# Altium schematic sheet C.SchDoc
size A
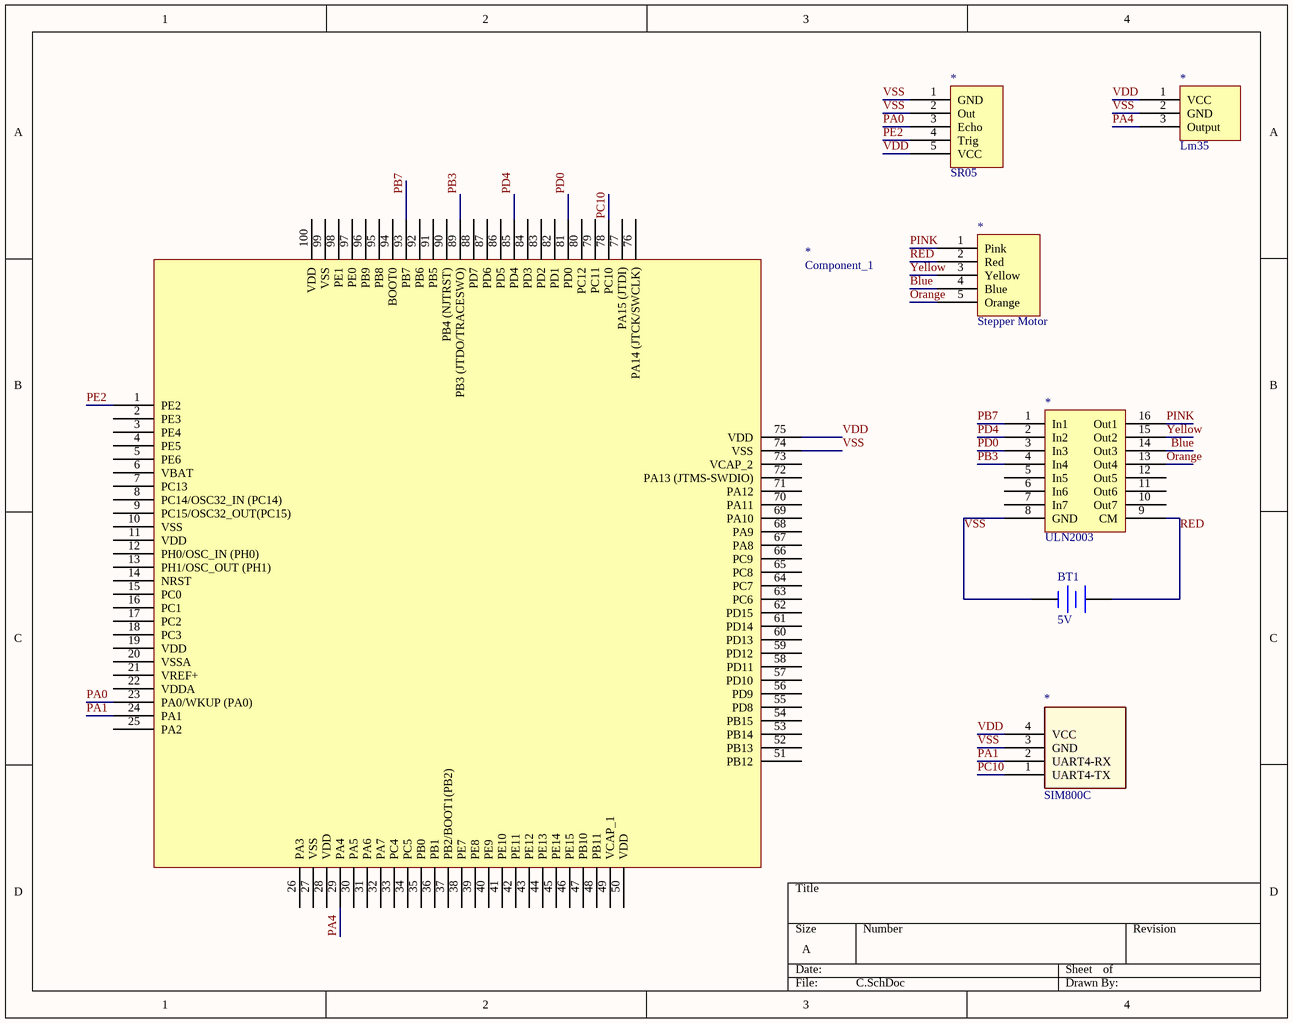
[diagram p0: C.SchDoc]

## Parts
(Parts that share a designator on the sheet are numbered #1, #2 ... from top to bottom, then left to right.)
*#1  SR05
*#2  Lm35
*#3  Stepper Motor
*#4  ULN2003
*#5  Component_1
*#6  SIM800C
BT1  5V  [BAT-2]

## Nets
Blue: *#3.4(Blue) *#4.14(Out3)
Orange: *#3.5(Orange) *#4.13(Out4)
PA0: *#1.3(Echo) *#5.23(PA0/WKUP_(PA0))
PA1: *#5.24(PA1) *#6.2(UART4-RX)
PA4: *#2.3(Output) *#5.29(PA4)
PB3: *#4.4(In4) *#5.89(PB3_(JTDO/TRACESWO))
PB7: *#4.1(In1) *#5.93(PB7)
PC10: *#5.78(PC10) *#6.1(UART4-TX)
PD0: *#4.3(In3) *#5.81(PD0)
PD4: *#4.2(In2) *#5.85(PD4)
PE2: *#1.4(Trig) *#5.1(PE2)
PINK: *#3.1(Pink) *#4.16(Out1)
RED: *#3.2(Red) *#4.9(CM) BT1.1(+)
VDD: *#1.5(VCC) *#2.1(VCC) *#5.75(VDD) *#6.4(VCC)
VSS: *#1.1(GND) *#1.2(Out) *#2.2(GND) *#4.8(GND) *#5.74(VSS) *#6.3(GND) BT1.2(-)
Yellow: *#3.3(Yellow) *#4.15(Out2)

Not connected (* = marked no-connect by the designer): *#4 5(In5) 6(In6) 7(In7) 10(Out7) 11(Out6) 12(Out5); *#5 2(PE3) 3(PE4) 4(PE5) 5(PE6) 6(VBAT) 7(PC13) 8(PC14/OSC32_IN_(PC14)) 9(PC15/OSC32_OUT(PC15)) 10(VSS) 11(VDD) 12(PH0/OSC_IN_(PH0)) 13(PH1/OSC_OUT_(PH1)) 14(NRST) 15(PC0) 16(PC1) 17(PC2) 18(PC3) 19(VDD) 20(VSSA) 21(VREF+) 22(VDDA) 25(PA2) 26(PA3) 27(VSS) 28(VDD) 30(PA5) 31(PA6) 32(PA7) 33(PC4) 34(PC5) 35(PB0) 36(PB1) 37(PB2/BOOT1(PB2)) 38(PE7) 39(PE8) 40(PE9) 41(PE10) 42(PE11) 43(PE12) 44(PE13) 45(PE14) 46(PE15) 47(PB10) 48(PB11) 49(VCAP_1) 50(VDD) 51(PB12) 52(PB13) 53(PB14) 54(PB15) 55(PD8) 56(PD9) 57(PD10) 58(PD11) 59(PD12) 60(PD13) 61(PD14) 62(PD15) 63(PC6) 64(PC7) 65(PC8) 66(PC9) 67(PA8) 68(PA9) 69(PA10) 70(PA11) 71(PA12) 72(PA13_(JTMS-SWDIO)) 73(VCAP_2) 76(PA14_(JTCK/SWCLK)) 77(PA15_(JTDI)) 79(PC11) 80(PC12) 82(PD1) 83(PD2) 84(PD3) 86(PD5) 87(PD6) 88(PD7) 90(PB4_(NJTRST)) 91(PB5) 92(PB6) 94(BOOT0) 95(PB8) 96(PB9) 97(PE0) 98(PE1) 99(VSS) 100(VDD)

## Library data of the parts
BT1 = Battery: Multicell Battery; Published: 24-Mar-1999; LatestRevisionDate: 17-Jul-2002; LatestRevisionNote: Re-released for DXP Platform.; PackageReference: BAT-2; Publisher: Altium Limited; PackageDescription: Battery; 2 Leads